# EAGLE design provisorio_5 (EAGLE 7.4.0)
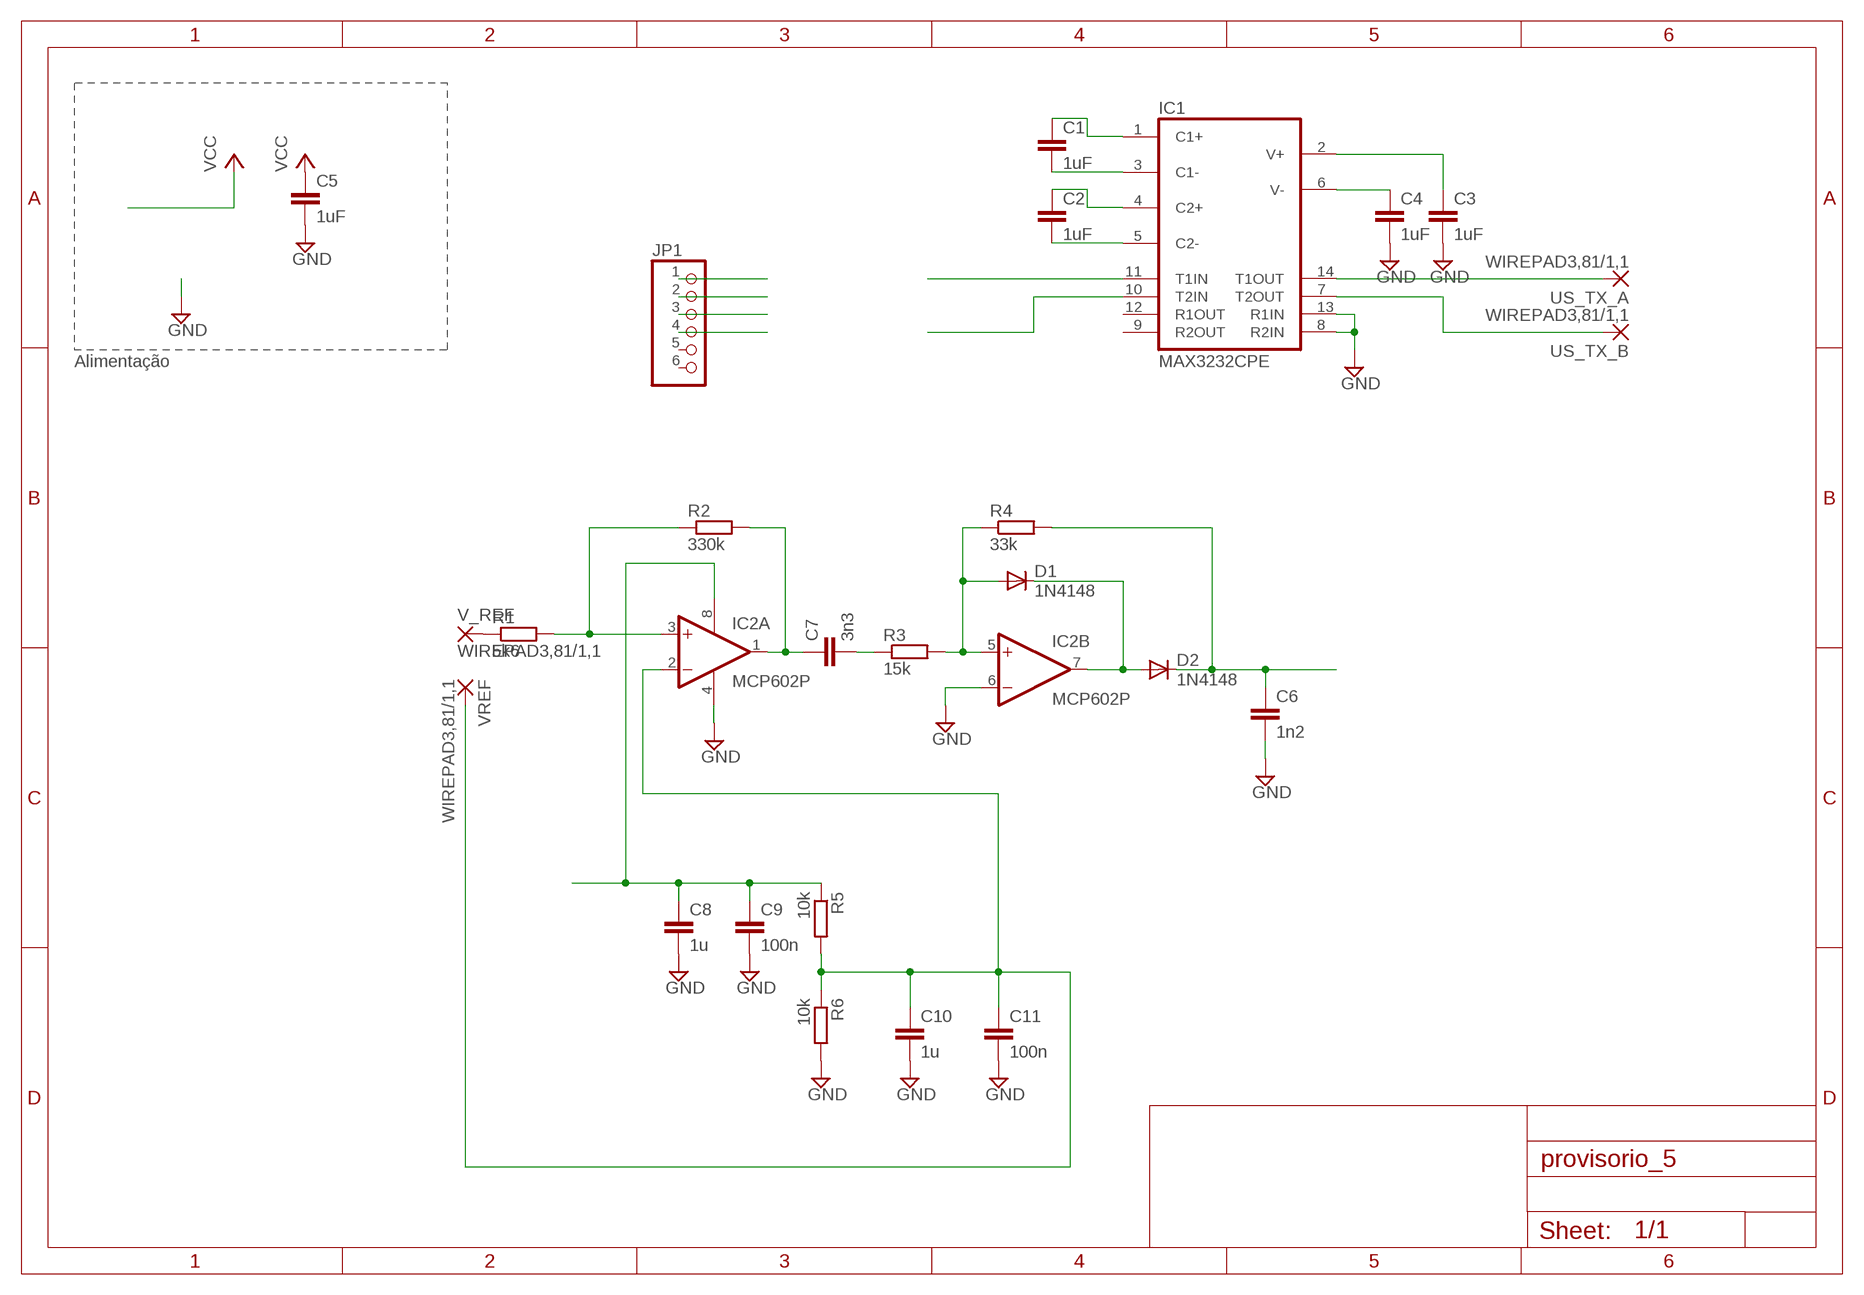
[diagram p0: schematic, sheet 1]

## Parts
C1  1uF  C-EUC1206K  [C1206K]
C2  1uF  C-EUC1206K  [C1206K]
C3  1uF  C-EUC1206K  [C1206K]
C4  1uF  C-EUC1206K  [C1206K]
C5  1uF  C-EUC1206K  [C1206K]
C6  1n2  C-EUC1206K  [C1206K]
C7  3n3  C-EUC1206K  [C1206K]
C8  1u  C-EUC1206K  [C1206K]
C9  100n  C-EUC1206K  [C1206K]
C10  1u  C-EUC1206K  [C1206K]
C11  100n  C-EUC1206K  [C1206K]
D1  1N4148  DIODE-SOD123  [SOD123]
D2  1N4148  DIODE-SOD123  [SOD123]
IC1  MAX3232CPE  [DIL16]
IC2  MCP602P  [DIL08]
JP1  PINHD-1X6  [1X06]
R1  5k6  R-EU_R1206  [R1206]
R2  330k  R-EU_R1206  [R1206]
R3  15k  R-EU_R1206  [R1206]
R4  33k  R-EU_R1206  [R1206]
R5  10k  R-EU_R1206  [R1206]
R6  10k  R-EU_R1206  [R1206]
US_TX_A  WIREPAD3,81/1,1  [3,81/1,1]
US_TX_B  WIREPAD3,81/1,1  [3,81/1,1]
V_REF  WIREPAD3,81/1,1  [3,81/1,1]
VREF  WIREPAD3,81/1,1  [3,81/1,1]

## Nets
DIGI1: C6.1 D2.C IC1.11(T1IN) JP1.2 R4.2
DIGI2: IC1.10(T2IN) JP1.1
GND: C3.2 C4.2 C5.2 C6.2 C8.2 C9.2 C10.2 C11.2 IC1.8(R2IN) IC1.13(R1IN) IC2.4(P:V-) IC2.6(B:-IN) JP1.3 R6.2
N$1: C3.1 IC1.2(V+)
N$4: C2.2 IC1.5(C2-)
N$5: C2.1 IC1.4(C2+)
N$6: C1.2 IC1.3(C1-)
N$7: C1.1 IC1.1(C1+)
N$8: C4.1 IC1.6(V-)
N$9: IC1.14(T1OUT) US_TX_A.1(P)
N$10: IC1.7(T2OUT) US_TX_B.1(P)
N$11: IC2.3(A:+IN) R1.2 R2.1
N$12: C7.1 IC2.1(A:OUT) R2.2
N$13: C7.2 R3.1
N$14: D1.A IC2.5(B:+IN) R3.2 R4.1
N$15: D1.C D2.A IC2.7(B:OUT)
N$17: R1.1 V_REF.1(P)
N$19: C10.1 C11.1 IC2.2(A:-IN) R5.2 R6.1 VREF.1(P)
VCC: C5.1 C8.1 C9.1 IC2.8(P:V+) JP1.4 R5.1
Unconnected: IC1.9(R2OUT) IC1.12(R1OUT) JP1.5 JP1.6

## Notes on the sheet
- Alimentação

## Power pins joined to a net without a drawn wire
GND: IC1.15(GND)
VCC: IC1.16(VCC)

## Library data of the parts
C1-C11 = rcl:C-EU: CAPACITOR, European symbol
D1 D2 = diode:DIODE-: DIODE
IC1 = maxim:MAX3232*: True RS-232 Transceivers 3.0V to 5.5V, Low-Power up to 1Mbps, Using Four 0.1µF External Capacitors Source: http://pdfserv.maxim-ic.com/en/ds/MAX3222-MAX3241.pdf; MF: MAXIM; MPN: MAX3232CPE+; OC_FARNELL: 9724494; OC_NEWARK: 68K4626
IC2 = linear:MCP602: Single Op Amp 2.7V to 6.0V Single Supply CMOS Source: http://ww1.microchip.com/downloads/en/DeviceDoc/21314g.pdf
JP1 = pinhead:PINHD-1X6: PIN HEADER
R1-R6 = rcl:R-EU_: RESISTOR, European symbol
US_TX_A US_TX_B V_REF VREF = wirepad:WIREPAD: Wire PAD connect wire on PCB

## Board
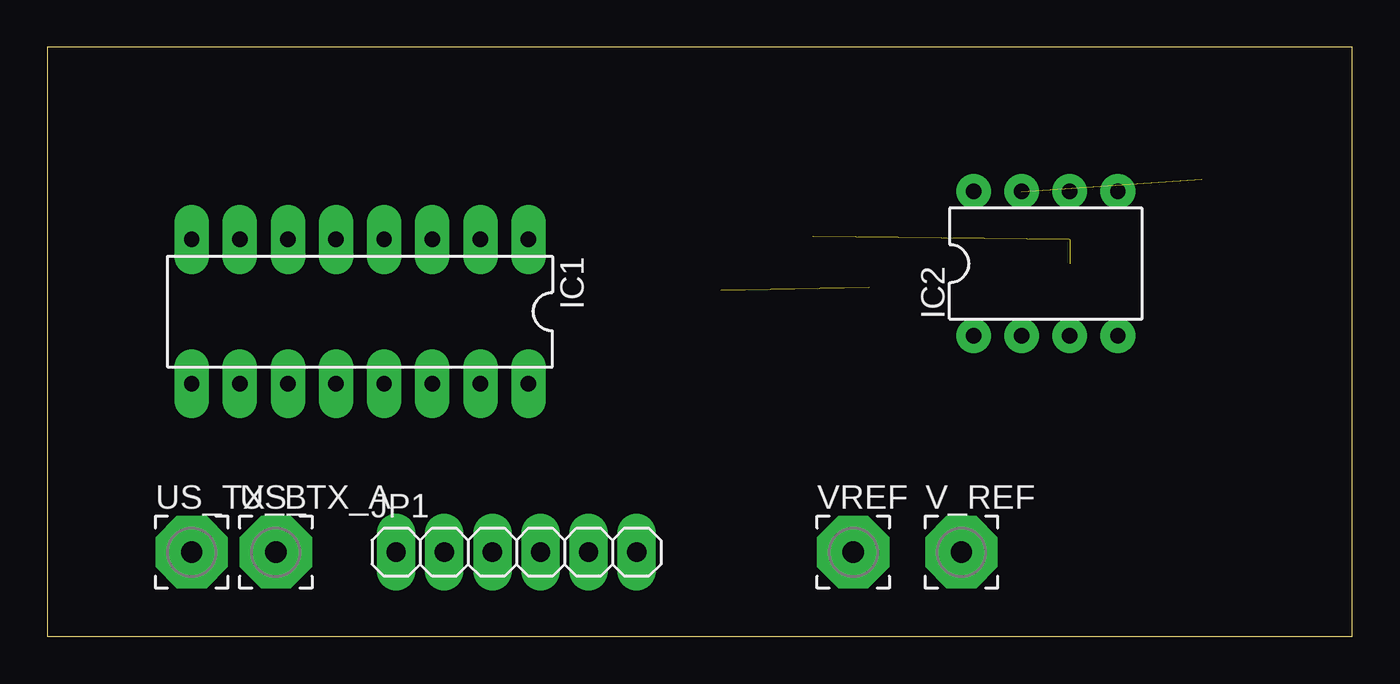
[diagram p1: board, top side]
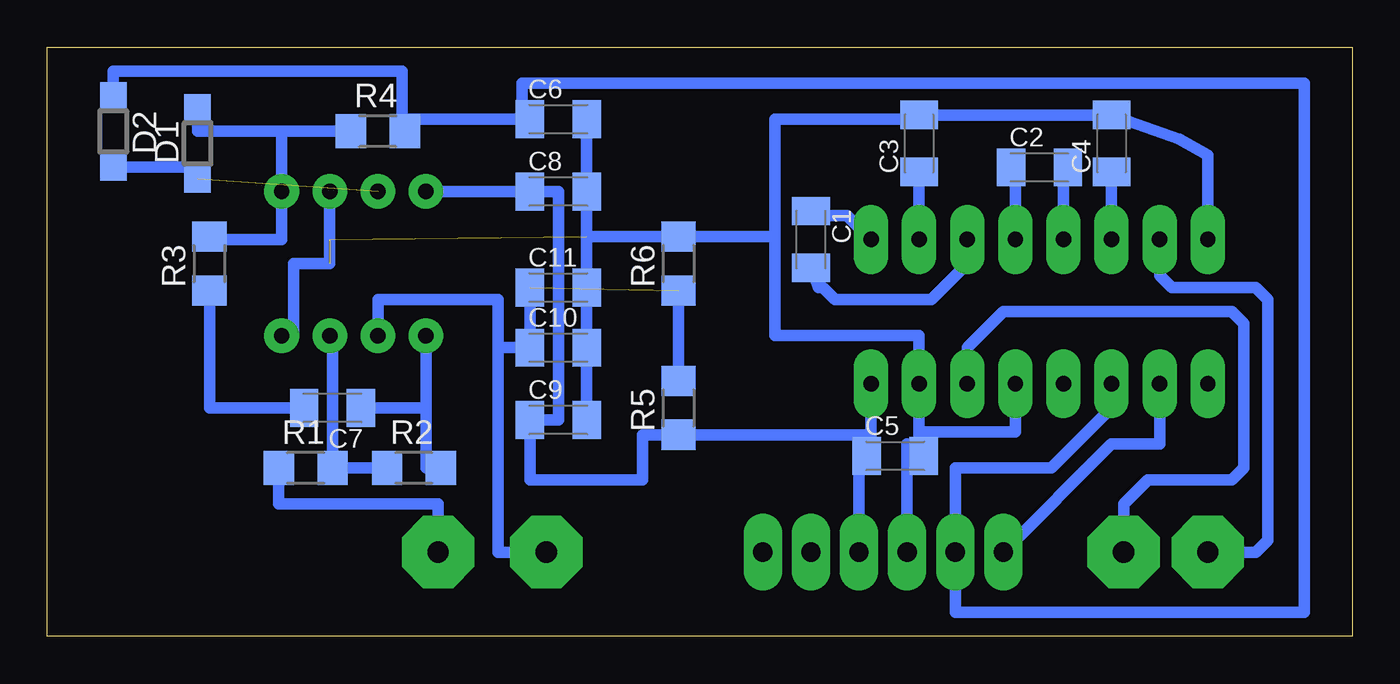
[diagram p2: board, bottom side, seen from below]

Size 68.89 x 31.11 mm. Coordinates in mm from the lower left corner, seen from the top.
Outline: 0,0 68.89,0 68.89,31.11 0,31.11 0,0
Copper layers (1*16): Top 0.035mm / dielectric 1.5mm / Bottom 0.035mm
Design rules "LabE_2016": minimum track width 16mil, minimum drill 0.8mm, track to track 16mil, track to pad 16mil, pad to pad 16mil, via to via 16mil, smd to smd 16mil, copper to edge 0mil, drill to drill 16mil, minimum pad ring 20mil, minimum via ring 20mil, stop-mask expansion 4mil, vias tented up to drill 0mil, thermal gap 10mil

### Footprints (pad centres in the part's own frame; a part is rotated, then mirrored left to right if it is on the bottom)
C1206K = smd 1.5 x 2: 1 -1.5,0; 2 1.5,0
SOD123 = smd 1.4 x 1.4: A 1.9,0; C -1.9,0
DIL16 = drill 0.813 long: 1 -8.89,-3.81; 2 -6.35,-3.81; 3 -3.81,-3.81; 4 -1.27,-3.81; 5 1.27,-3.81; 6 3.81,-3.81; 7 6.35,-3.81; 8 8.89,-3.81; 9 8.89,3.81; 10 6.35,3.81; 11 3.81,3.81; 12 1.27,3.81; 13 -1.27,3.81; 14 -3.81,3.81; 15 -6.35,3.81; 16 -8.89,3.81
DIL08 = drill 0.813 pad 1.27: 1 -3.81,-3.81; 2 -1.27,-3.81; 3 1.27,-3.81; 4 3.81,-3.81; 5 3.81,3.81; 6 1.27,3.81; 7 -1.27,3.81; 8 -3.81,3.81
1X06 = drill 1.016 long: 1 -6.35,0; 2 -3.81,0; 3 -1.27,0; 4 1.27,0; 5 3.81,0; 6 6.35,0
R1206 = smd 1.6 x 1.803: 1 -1.422,0; 2 1.422,0
3,81/1,1 = drill 1.118 pad 3.81 octagon: 1 0,0

### Placement (x,y rotation side)
C1  28.57,20.95 270 bottom
C2  16.51,24.77 0 bottom
C3  22.86,26.04 90 bottom
C4  12.7,26.04 90 bottom
C5  24.13,9.53 0 bottom
C6  41.91,27.3 0 bottom
C7  53.83,12.06 180 bottom
C8  41.91,23.5 0 bottom
C9  41.91,11.43 0 bottom
C10  41.91,15.24 0 bottom
C11  41.91,18.41 0 bottom
D1  60.96,26.04 90 bottom
D2  65.41,26.67 270 bottom
IC1  16.51,17.14 180 top
IC2  52.7,19.68 0 top
JP1  24.77,4.45 0 top
R1  55.24,8.89 0 bottom
R2  49.53,8.89 0 bottom
R3  60.33,19.68 90 bottom
R4  51.44,26.67 0 bottom
R5  35.56,12.06 90 bottom
R6  35.56,19.68 90 bottom
US_TX_A  12.06,4.45 0 top
US_TX_B  7.62,4.45 0 top
V_REF  48.26,4.45 0 top
VREF  42.55,4.45 0 top

### Tracks (layer width: path | path; a pad name or v marks a point on that pad's centre or on a via)
DIGI1
  Bottom 0.61: 50.01,27.3 C6.1 43.81,27.3 43.81,29.21 2.54,29.21 2.54,1.27 20.95,1.27 JP1.2 20.95,8.89 15.88,8.89 12.7,12.06 IC1.11 | 50.01,27.3 R4.2 | 50.01,27.3 50.16,27.3 50.16,29.84 65.41,29.84 D2.C
DIGI2
  Bottom 0.61: IC1.10 10.16,10.16 12.7,10.16 JP1.1
GND  (2 unrouted)
  Bottom 0.61: IC1.8 7.62,25.4 9.12,26.27 C4.2 C3.2 22.86,27.3 30.48,27.3 30.48,21.11 | 22.86,10.79 IC1.15 22.86,15.88 30.48,15.88 30.48,21.11 | 22.86,10.79 22.86,10.39 C5.2 | IC1.13 17.78,10.79 22.86,10.79 | 22.86,10.79 C5.2 | C9.2 C10.2 C11.2 40.41,21.11 | 30.48,21.11 R6.2 40.41,21.11 | C8.2 C6.2 | C8.2 40.64,23.5 | IC2.4 55.88,15.88 55.88,19.68 53.98,19.68 IC2.6 | 40.41,21.11 C8.2 | C5.2 23.5,10.16 JP1.3
N$1
  Bottom 0.61: IC1.2 C3.1
N$4
  Bottom 0.61: IC1.5 15.24,24.54 C2.2
N$5
  Bottom 0.61: IC1.4 17.78,24.54 C2.1
N$6
  Bottom 0.61: IC1.3 20.32,19.68 22.23,17.78 27.3,17.78 27.94,18.41 28.17,18.41 C1.2
N$7
  Bottom 0.61: IC1.1 26.67,22.23 28.98,22.23 C1.1
N$8
  Bottom 0.61: IC1.6 C4.1
N$9
  Bottom 0.61: US_TX_A.1 12.06,6.99 10.79,8.26 6.35,8.26 5.71,8.89 5.71,16.51 6.35,17.14 18.41,17.14 20.32,15.24 IC1.14
N$10
  Bottom 0.61: IC1.7 10.16,19.05 9.53,18.41 5.08,18.41 4.45,17.78 4.45,5.08 5.08,4.45 US_TX_B.1
N$11
  Bottom 0.61: R2.1 R1.2 53.82,15.24 IC2.3
N$12
  Bottom 0.61: 48.9,12.06 IC2.1 | R2.2 48.9,8.89 48.9,12.06 | 48.9,12.06 C7.1
N$13
  Bottom 0.61: C7.2 60.33,12.06 R3.1
N$14
  Bottom 0.61: R4.1 56.52,26.67 | 56.52,26.67 60.96,26.67 D1.A | 56.52,26.67 IC2.5 56.52,20.95 60.33,20.95 R3.2
N$15  (1 unrouted)
  Bottom 0.61: D2.A 60.96,24.77 D1.C
N$17
  Bottom 0.61: V_REF.1 48.26,6.99 56.67,6.99 R1.1
N$19  (1 unrouted)
  Bottom 0.61: VREF.1 45.09,4.45 45.09,15.24 | 45.09,15.24 C10.1 C11.1 | R6.1 R5.2 | 45.09,15.24 45.09,17.78 51.44,17.78 IC2.2
VCC
  Bottom 0.61: IC1.16 25.4,10.39 C5.1 | IC2.8 C8.1 41.91,23.5 41.91,11.43 C9.1 43.41,8.26 37.47,8.26 37.47,10.64 R5.1 25.63,10.64 C5.1 | C5.1 26.04,10.16 JP1.4